# Altium schematic sheet RS232.SchDoc
size A3; Date: *******; ApprovedBy: *******; CheckedBy: None; Author: *******; CompanyName: *******; DrawnBy: V.HIEU; Engineer: *******; Organization: *******; Address2: *******; Address3: *******; Address4: *******; DocumentNumber: Doc Num; Revision: V1.0; Email: truongvanhieu17102005@gmail.com; SheetNumber: 7; SheetTotal: 9; CurrentTime: *******; CurrentDate: *******; Time: *******; DocumentFullPathAndName: *******; DocumentName: *******; ModifiedDate: *******; ImagePath: *******; ProjectName: *******; Application_BuildNumber: *******
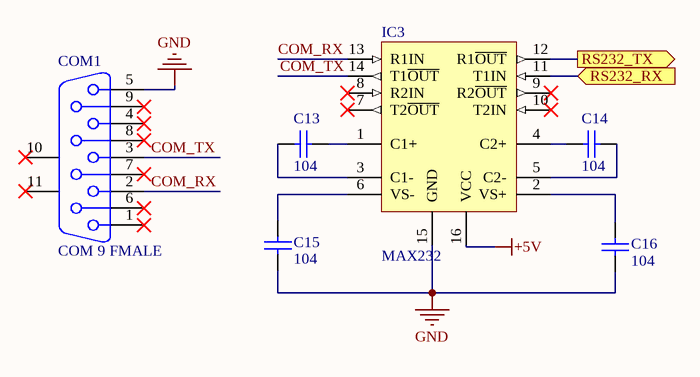
[diagram p0: RS232.SchDoc]

## Parts
C13  104  [tu 0805]
C14  104  [tu 0805]
C15  104  [tu 0805]
C16  104  [tu 0805]
COM1  COM 9 FMALE  [DSB 9-F]
IC3  MAX232  [SO-G16]

## Ports
RS232_RX (in), RS232_TX (out)

## Nets
+5V: IC3.16(VCC)
GND: C15.2 C16.2 COM1.5 IC3.15(GND)
COM_RX: COM1.2 IC3.13(R1IN)
COM_TX: COM1.3 IC3.14(T1~{OUT})
RS232_RX: IC3.11(T1IN) ; port RS232_RX
RS232_TX: IC3.12(R1~{OUT}) ; port RS232_TX
NetC13_1: C13.1 IC3.3(C1-)
NetC13_2: C13.2 IC3.1(C1+)
NetC14_1: C14.1 IC3.5(C2-)
NetC14_2: C14.2 IC3.4(C2+)
NetC15_1: C15.1 IC3.6(VS-)
NetC16_1: C16.1 IC3.2(VS+)

Not connected (* = marked no-connect by the designer): COM1 1* 4* 6* 7* 8* 9* 10(MH1)* 11(MH2)*; IC3 7(T2~{OUT})* 8(R2IN)* 9(R2~{OUT})* 10(T2IN)*

## Notes on the sheet
- Title:
- Size:
- Drawn By:
- Page Contents:
- A3
- Number:
- Checked By:
- Revision:
- Date:
- File:
- License:
- Email:
- Time:
- Sheet
- Website:
- of

## Library data of the parts
C13-C16 = Tu 0805 104 50V 10%: Dán; Don_Vi: Con; So_Chan: 2; Ten_Linh_Kien: Tụ 0805 104-100nF 10% 50V; Ma_Hang: MH004551; Chung_Loai: Dán; Kieu_Chan: *
COM1 = DSB9F: COM 9; PackageDocument: O; Positions: 9; Gender: Receptacle; Value: COM 9; Published: 15-Jun-2001; LatestRevisionDate: 17-Jul-2002; LatestRevisionNote: Re-released for DXP Platform.; DatasheetDocument: 1-Sep-1999; PackageReference: 788750; Publisher: Altium Limited; Orientation: Right Angle
IC3 = MAX232: Dual EIA-232 Driver/Receiver; Value: MAX232